# Altium schematic sheet EPaper.SchDoc
size A
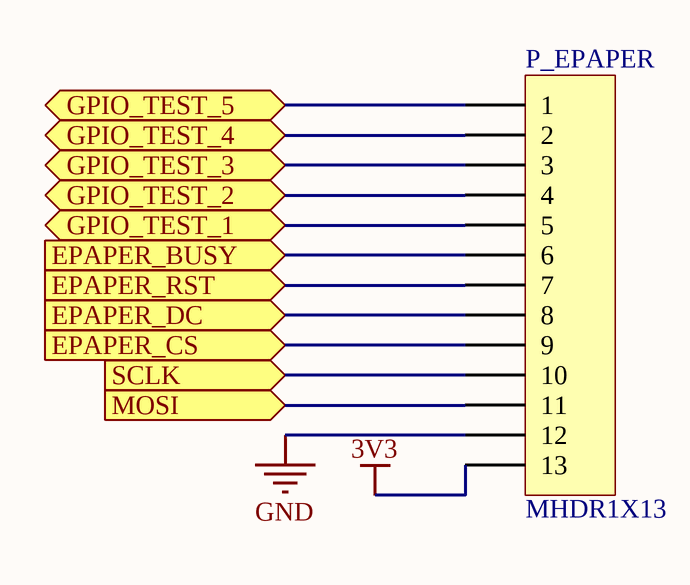
[diagram p0: EPaper.SchDoc]

## Parts
P_EPAPER  MHDR1X13  [MHDR1X13]

## Ports
EPAPER_BUSY (in), EPAPER_CS (in), EPAPER_DC (in), EPAPER_RST (in), GPIO_TEST_1 (bidir), GPIO_TEST_2 (bidir), GPIO_TEST_3 (bidir), GPIO_TEST_4 (bidir), GPIO_TEST_5 (bidir), MOSI (in), SCLK (in)

## Nets
3V3: P_EPAPER.13
GND: P_EPAPER.12
EPAPER_BUSY: P_EPAPER.6 ; port EPAPER_BUSY
EPAPER_CS: P_EPAPER.9 ; port EPAPER_CS
EPAPER_DC: P_EPAPER.8 ; port EPAPER_DC
EPAPER_RST: P_EPAPER.7 ; port EPAPER_RST
GPIO_TEST_1: P_EPAPER.5 ; port GPIO_TEST_1
GPIO_TEST_2: P_EPAPER.4 ; port GPIO_TEST_2
GPIO_TEST_3: P_EPAPER.3 ; port GPIO_TEST_3
GPIO_TEST_4: P_EPAPER.2 ; port GPIO_TEST_4
GPIO_TEST_5: P_EPAPER.1 ; port GPIO_TEST_5
MOSI: P_EPAPER.11 ; port MOSI
SCLK: P_EPAPER.10 ; port SCLK

## Library data of the parts
P_EPAPER = MHDR1X13: Header, 13-Pin; LatestRevisionDate: 17-Jul-2002; LatestRevisionNote: Re-released for DXP Platform.; Publisher: Altium Limited